# Altium schematic sheet Architecture.SchDoc: Hardware architecture
size A4; CheckedBy: none; Organization: ORGANIZATION; Address1: ADDRESS 1; Address2: ADDRESS 2; Address3: ADDRESS 3; Address4: ADDRESS 4; Revision: -; SheetNumber: 1; SheetTotal: 5; ENG_APP_DATE: --/--/--; DSN_APP_DATE: --/--/--; CHK_APP_DATE: --/--/--
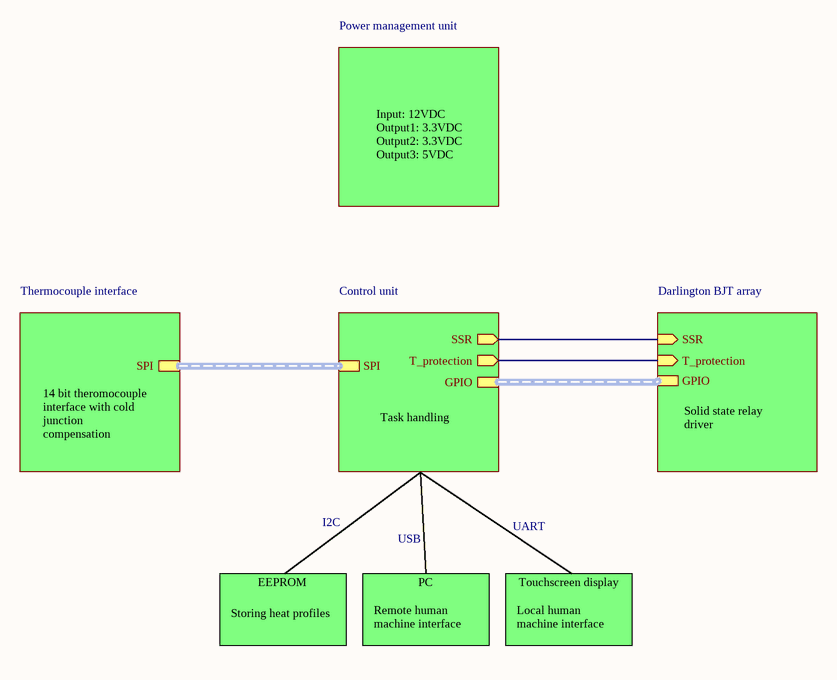
[diagram p0: Architecture.SchDoc]

## Sub-sheets
Control unit = ControlUnit.SchDoc: SPI (harness SPI), SSR (out), T_protection (out), GPIO (harness GPIO)
Darlington BJT array = DarlingtonBJTArray.SchDoc: SSR (in), T_protection (in), GPIO (harness GPIO)
Power management unit = Pwr management.SchDoc: no entries
Thermocouple interface = Thermocouple interface.SchDoc: SPI (harness SPI)

## Nets
(unnamed): sheet Control unit/SSR, sheet Darlington BJT array/SSR
(unnamed): sheet Control unit/T_protection, sheet Darlington BJT array/T_protection

## Buses and harness runs
harness sheet Control unit/GPIO = sheet Darlington BJT array/GPIO
harness sheet Control unit/SPI = sheet Thermocouple interface/SPI

## Notes on the sheet
- Input: 12VDC
  Output1: 3.3VDC
  Output2: 3.3VDC
  Output3: 5VDC
- 14 bit theromocouple interface with cold junction compensation
- Task handling
- Solid state relay driver
- I2C
- USB
- UART
- EEPROM
- Storing heat profiles
- PC
- Remote human machine interface
- Touchscreen display
- Local human machine interface
- Project:
- Title:
- Drawn by:
- Date and time:
- Checked by:
- Budapest University of Technology and Economics
- Faculty of Electrical Engineering and Informatics
- Sheet
- of
- Size:
- A4
- Revision: